# EAGLE design untitled (EAGLE 9.6.0)
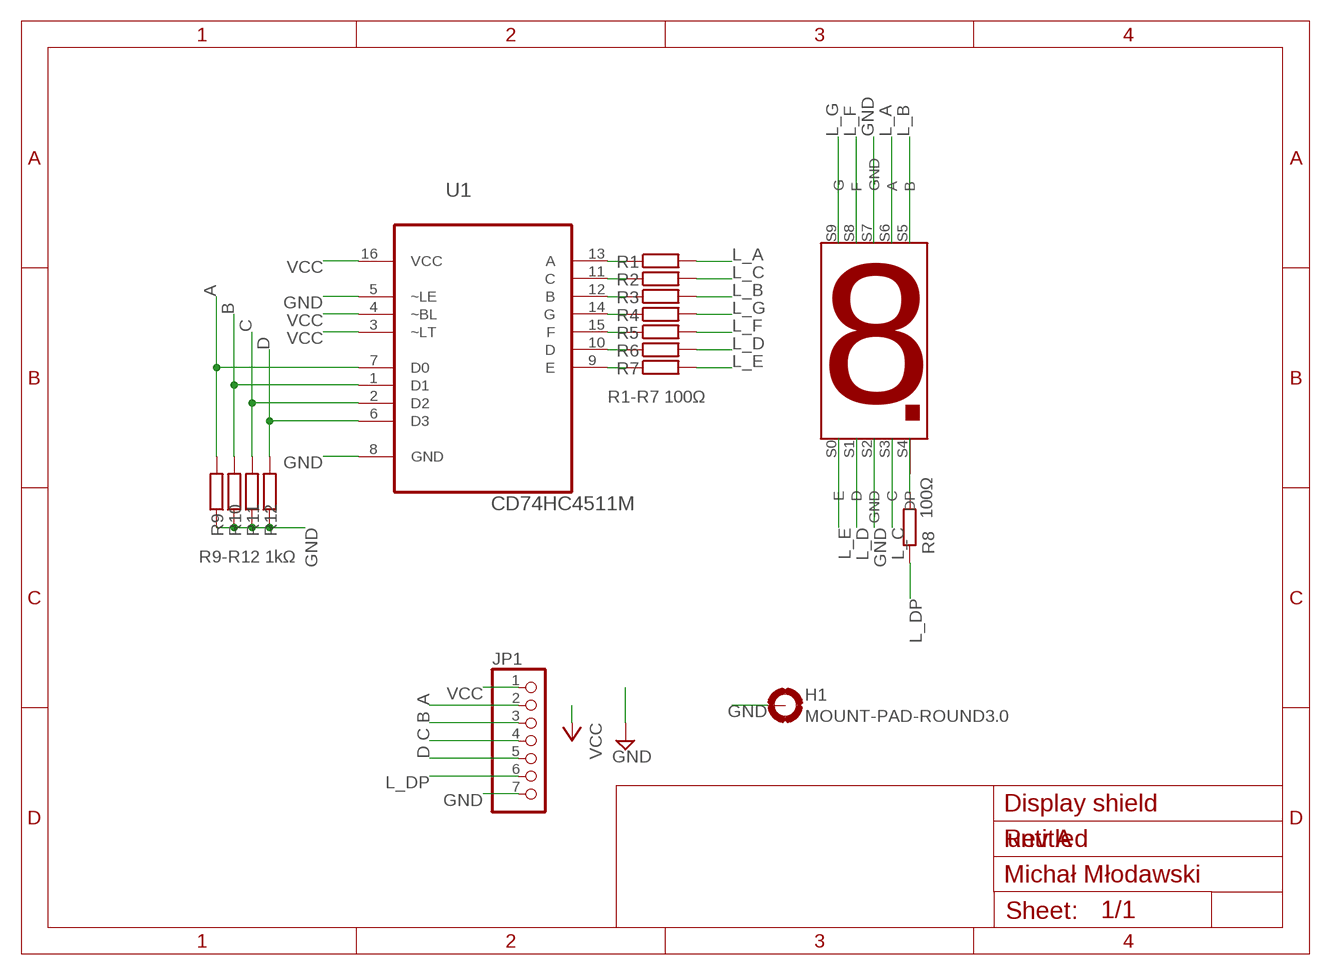
[diagram p0: schematic, sheet 1]

## Parts
H1  MOUNT-PAD-ROUND3.0  [3,0-PAD]
JP1  PINHD-1X7  [1X07]
R1  R-EU_R1206  [R1206]
R2  R-EU_R1206  [R1206]
R3  R-EU_R1206  [R1206]
R4  R-EU_R1206  [R1206]
R5  R-EU_R1206  [R1206]
R6  R-EU_R1206  [R1206]
R7  R-EU_R1206  [R1206]
R8  100Ω  R-EU_R1206  [R1206]
R9  R-EU_R1206  [R1206]
R10  R-EU_R1206  [R1206]
R11  R-EU_R1206  [R1206]
R12  R-EU_R1206  [R1206]
U1  CD74HC4511M  [SOIC127P600X175-16N]
U$1  7-SEGMENT-DISPLAY  [7-SEGMENTDISPLAY]

## Nets
A: JP1.2 R9.2 U1.7(D0)
B: JP1.3 R10.2 U1.1(D1)
C: JP1.4 R11.2 U1.2(D2)
D: JP1.5 R12.2 U1.6(D3)
GND: H1.B3,0(MOUNT) JP1.7 R9.1 R10.1 R11.1 R12.1 U1.5(~LE) U1.8(GND) U$1.S2(GND) U$1.S7(GND)
L_A: R1.2 U$1.S6(A)
L_B: R3.2 U$1.S5(B)
L_C: R2.2 U$1.S3(C)
L_D: R6.2 U$1.S1(D)
L_DP: JP1.6 R8.1
L_E: R7.2 U$1.S0(E)
L_F: R5.2 U$1.S8(F)
L_G: R4.2 U$1.S9(G)
N$1: R1.1 U1.13(A)
N$2: R2.1 U1.11(C)
N$3: R3.1 U1.12(B)
N$4: R4.1 U1.14(G)
N$5: R5.1 U1.15(F)
N$6: R6.1 U1.10(D)
N$7: R7.1 U1.9(E)
N$12: R8.2 U$1.S4(DP)
VCC: JP1.1 U1.3(~LT) U1.4(~BL) U1.16(VCC)

## Notes on the sheet
- R1-R7 100Ω
- R9-R12 1kΩ
- Display shield
- Rev A
- Michał Młodawski

## Library data of the parts
H1 = holes:MOUNT-PAD-ROUND: MOUNTING PAD, round
JP1 = pinhead:PINHD-1X7: PIN HEADER
R1-R12 = resistor:R-EU_: RESISTOR, European symbol
U1 = CD74HC4511M:CD74HC4511M: BCD to Seven segment Latch/Decoders/Drivers; AVAILABILITY: Unavailable; DESCRIPTION: IC DRVR 7 SEGMENT 1 DIGIT 16SOIC; MF: Texas Instruments; MP: CD74HC4511M; PACKAGE: SOIC-16 Texas Instruments; PRICE: None
U$1 = 7display:7-SEGMENT-DISPLAY

## Board
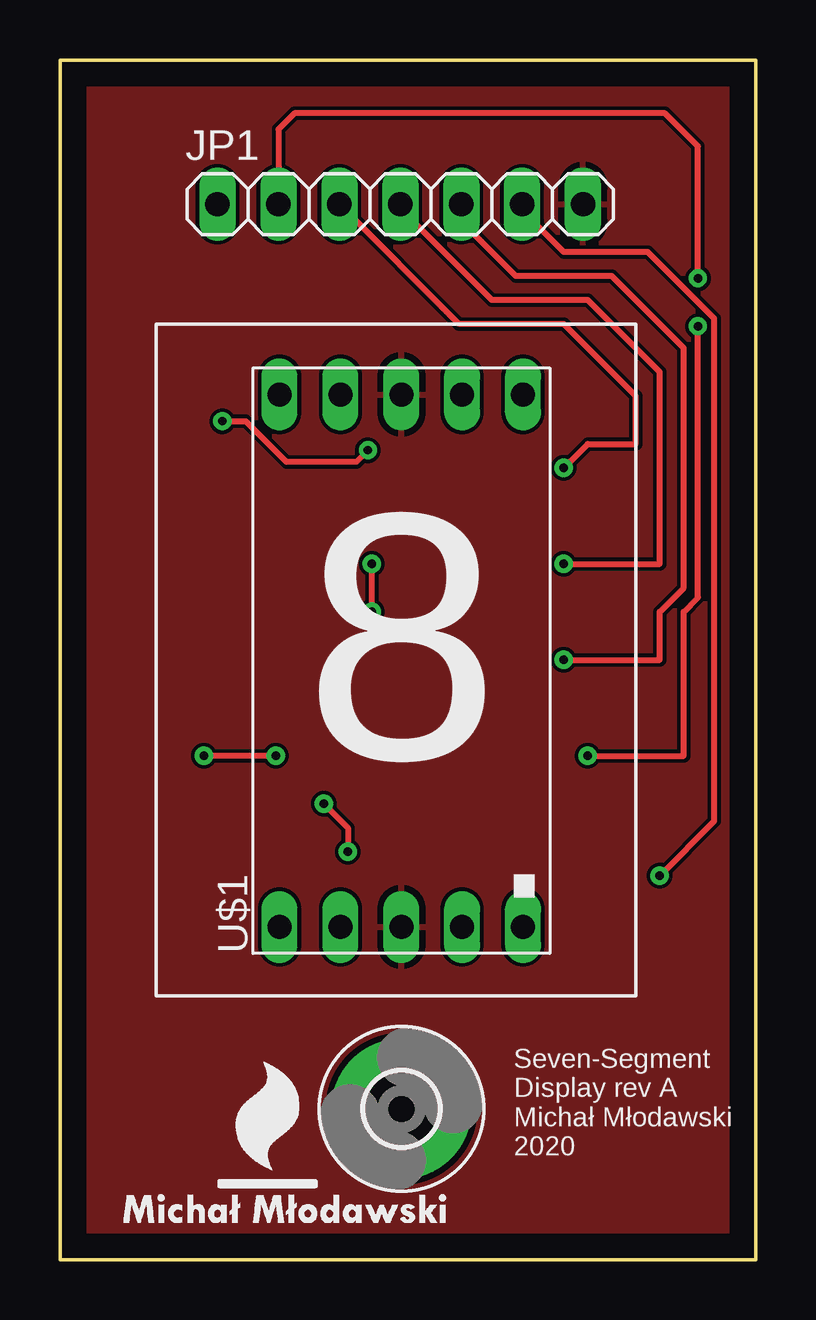
[diagram p1: board, top side]
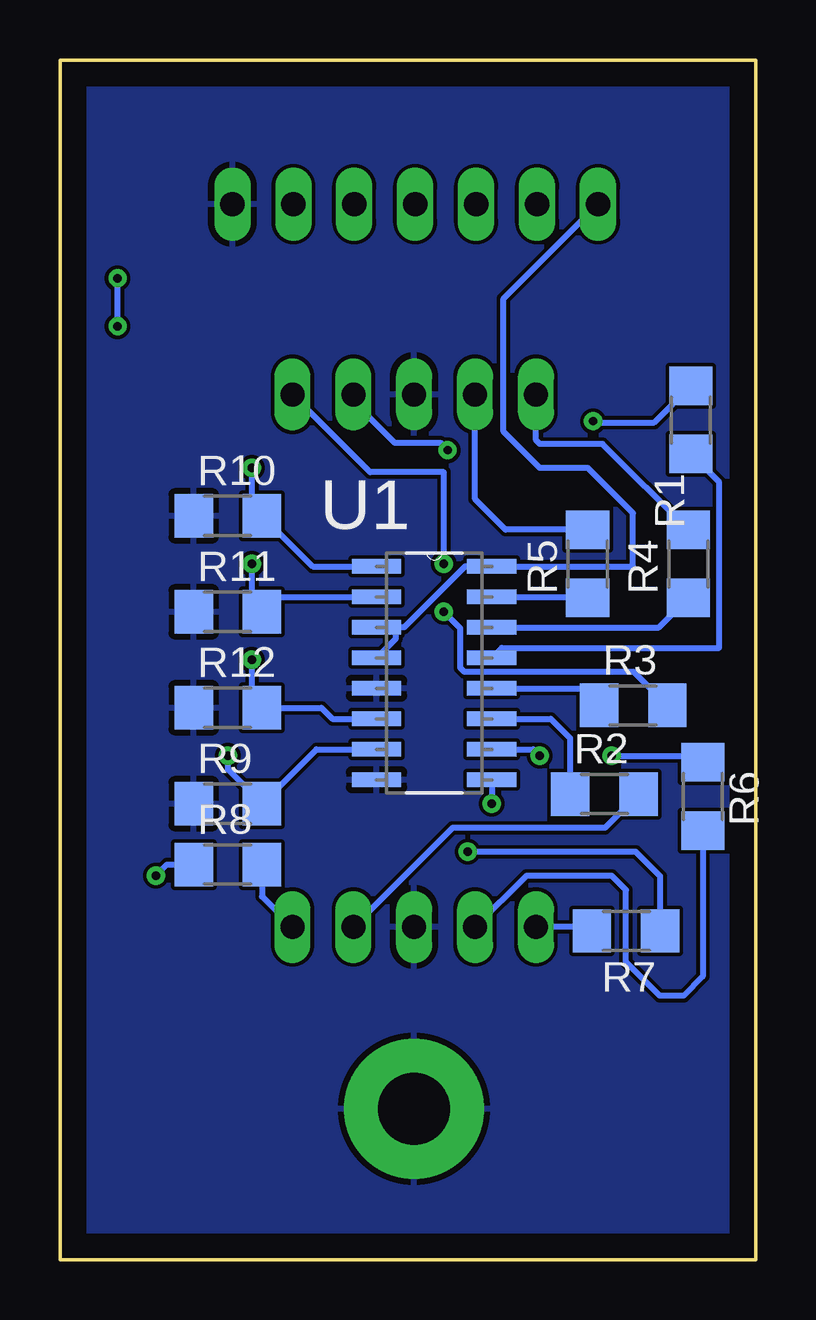
[diagram p2: board, bottom side, seen from below]

Size 29 x 50 mm. Coordinates in mm from the lower left corner, seen from the top.
Outline: 0,50 0,0 29,0 29,50 0,50
Copper layers (1*16): Top 0.035mm / dielectric 1.5mm / Bottom 0.035mm
Design rules "default": minimum track width 6mil, minimum drill 0.35mm, track to track 6mil, track to pad 6mil, pad to pad 6mil, via to via 6mil, smd to smd 6mil, copper to edge 40mil, drill to drill 6mil, minimum pad ring 10mil, minimum via ring 8mil, stop-mask expansion 4mil, vias tented up to drill 0mil, thermal gap 10mil

### Footprints (pad centres in the part's own frame; a part is rotated, then mirrored left to right if it is on the bottom)
3,0-PAD = drill 3 pad 5.842: B3,0 0,0
1X07 = drill 1.016 long: 1 -7.62,0; 2 -5.08,0; 3 -2.54,0; 4 0,0; 5 2.54,0; 6 5.08,0; 7 7.62,0
R1206 = smd 1.6 x 1.803: 1 -1.422,0; 2 1.422,0
SOIC127P600X175-16N = smd 2.057 x 0.61: 1 -4.801,8.89; 2 -4.801,7.62; 3 -4.801,6.35; 4 -4.801,5.08; 5 -4.801,3.81; 6 -4.801,2.54; 7 -4.801,1.27; 8 -4.801,0; 9 0,0; 10 0,1.27; 11 0,2.54; 12 0,3.81; 13 0,5.08; 14 0,6.35; 15 0,7.62; 16 0,8.89
7-SEGMENTDISPLAY = drill 1 long: S0 -5,-12; S1 -2.46,-12; S2 0.08,-12; S3 2.62,-12; S4 5.16,-12; S5 5.16,10.2; S6 2.62,10.2; S7 0.08,10.2; S8 -2.46,10.2; S9 -5,10.2

### Placement (x,y rotation side)
H1  14.24,6.28 0 top
JP1  14.19,43.99 0 top
R1  2.7,35 90 bottom
R2  6.3,19.4 0 bottom
R3  5.1,23.1 0 bottom
R4  2.8,29 90 bottom
R5  7,29 90 bottom
R6  2.2,19.3 270 bottom
R7  5.4,13.7 180 bottom
R8  22,16.46 0 bottom
R9  22,19 0 bottom
R10  22,31 0 bottom
R11  22,27 0 bottom
R12  22,23 0 bottom
U1  11,20 0 bottom
U$1  14.15,25.86 0 top

### Tracks (layer width: path | path; a pad name or v marks a point on that pad's centre or on a via)
A  (via drill 0.35)
  Top 0.254: v22,21 26,21 26,27 26.6,27.6 v26.6,38.9 | v26.6,40.9 26.6,46.4 25.22,47.78 9.78,47.78 9.11,47.11 JP1.2
  Bottom 0.254: U1.7 18.31,21.27 R9.2 22,20.42 v22,21 | v26.6,38.9 v26.6,40.9
B  (via drill 0.35)
  Top 0.254: v21,33 22,34 24,34 24,36 21,39 16.64,39 JP1.3
  Bottom 0.254: U1.1 18.47,28.89 R10.2 21,31.42 v21,33
C  (via drill 0.35)
  Top 0.254: v21,29 25,29 25,37 22,40 18,40 14.19,43.81 JP1.4
  Bottom 0.254: U1.2 19.96,27.62 R11.2 21,27.42 v21,29
D  (via drill 0.35)
  Top 0.254: v21,25 25,25 25,27 26,28 26,38 23,41 19,41 16.73,43.27 JP1.5
  Bottom 0.254: U1.6 17.64,22.54 18.1,23 R12.2 21,23.42 v21,25
GND
  pour Bottom: 29,50 29,0 0,0 0,50
  pour Top: 29,50 29,0 0,0 0,50
L_A  (via drill 0.35)
  Top 0.254: v6.77,34.95 7.74,34.95 9.44,33.25 12.36,33.25 v12.84,33.73 v12.84,33.74
  Bottom 0.254: v12.84,33.74 13.15,34.04 15.04,34.04 16.77,35.77 U$1.S6 | R1.2 4.23,34.89 6.72,34.89 v6.77,34.95
L_B  (via drill 0.35)
  Top 0.254: v13,27 v13,29
  Bottom 0.254: R3.2 5.07,24.5 12.14,24.5 12.31,24.66 12.31,26.31 v13,27 | U$1.S5 16.06,32.81 13,32.81 v13,29
L_C
  Bottom 0.254: R2.2 6.28,18 12.63,18 U$1.S3
L_D
  Bottom 0.254: R6.2 2.2,11.8 3,11 4,11 5.4,12.4 5.4,15.4 6,16 9.55,16 U$1.S1
L_DP  (via drill 0.35)
  Top 0.254: JP1.6 19.27,43.73 21,42 24.5,42 27.28,39.22 27.28,18.28 v25,16
  Bottom 0.254: v25,16 24.54,16.46 R8.1
L_E
  Bottom 0.254: R7.2 6.98,13.86 U$1.S0
L_F
  Bottom 0.254: R5.2 10.42,30.42 11.69,31.69 U$1.S8
L_G
  Bottom 0.254: R4.2 6.38,34 9,34 9.15,34.15 U$1.S9
N$1
  Bottom 0.254: R1.1 1.52,32.4 1.52,25.5 10.58,25.5 U1.13
N$2
  Bottom 0.254: U1.11 8.54,22.54 7.72,21.72 R2.1
N$3
  Bottom 0.254: U1.12 7.23,23.81 R3.1
N$4
  Bottom 0.254: U1.14 4.03,26.35 R4.1
N$5
  Bottom 0.254: U1.15 7.04,27.62 R5.1
N$6  (via drill 0.35)
  Top 0.254: v9,21 v6,21
  Bottom 0.254: U1.10 9.27,21.27 v9,21 | v6,21 2.48,21 R6.1
N$7  (via drill 0.35)
  Top 0.254: v11,19 12,18 v12,17
  Bottom 0.254: U1.9 v11,19 | v12,17 5,17 3.98,15.98 R7.1
N$12
  Bottom 0.254: R8.2 20.58,15.13 U$1.S4
VCC
  Bottom 0.254: 15,26.35 14.65,26.35 12.11,28.89 U1.16 5.11,28.89 5.11,31.11 7,33 9,33 10.5,34.5 10.5,40.06 JP1.1 | 15,26.35 U1.3 | U1.4 15,25.88 15,26.35

### Text on the board
tPlace: Seven-Segment / Display rev A / Michał Młodawski / 2020